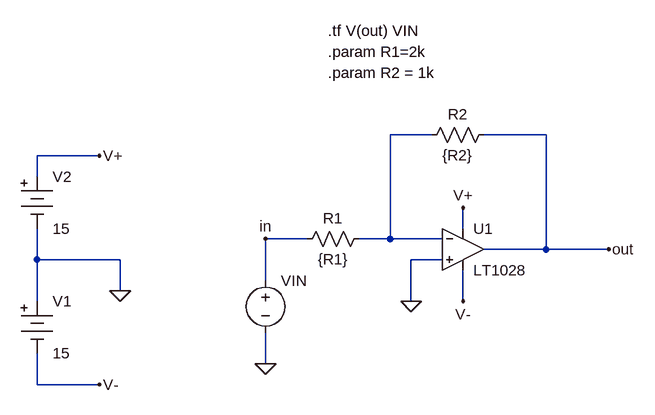
[diagram p0: schematic non_inverting_aop.asc]
non_inverting_aop.asc, the LTspice schematic file:
Version 4.1
SHEET 1 880 680
WIRE 272 0 208 0
WIRE 448 0 352 0
WIRE -240 32 -336 32
WIRE -336 64 -336 32
WIRE 320 144 320 112
WIRE 80 160 16 160
WIRE 208 160 208 0
WIRE 208 160 160 160
WIRE 288 160 208 160
WIRE 448 176 448 0
WIRE 448 176 352 176
WIRE 544 176 448 176
WIRE -336 192 -336 144
WIRE -208 192 -336 192
WIRE 288 192 240 192
WIRE 16 224 16 160
WIRE -208 240 -208 192
WIRE -336 256 -336 192
WIRE 240 256 240 192
WIRE 320 256 320 208
WIRE 16 352 16 304
WIRE -336 384 -336 336
WIRE -240 384 -336 384
FLAG 240 256 0
FLAG -208 240 0
FLAG -240 384 V-
FLAG -240 32 V+
FLAG 320 112 V+
FLAG 320 256 V-
FLAG 16 160 in
FLAG 544 176 out
FLAG 16 352 0
SYMBOL res 176 144 R90
WINDOW 0 0 56 VBottom 2
WINDOW 3 32 56 VTop 2
SYMATTR InstName R1
SYMATTR Value {R1}
SYMBOL res 368 -16 R90
WINDOW 0 0 56 VBottom 2
WINDOW 3 32 56 VTop 2
SYMATTR InstName R2
SYMATTR Value {R2}
SYMBOL OpAmps\\LT1028 320 112 R0
SYMATTR InstName U1
SYMBOL Misc\\battery -336 240 R0
WINDOW 123 0 0 Left 0
WINDOW 39 0 0 Left 0
SYMATTR InstName V1
SYMATTR Value 15
SYMBOL Misc\\battery -336 48 R0
WINDOW 123 0 0 Left 0
WINDOW 39 0 0 Left 0
SYMATTR InstName V2
SYMATTR Value 15
SYMBOL voltage 16 208 R0
WINDOW 123 0 0 Left 0
WINDOW 39 0 0 Left 0
SYMATTR InstName VIN
SYMATTR Value ""
TEXT 112 -128 Left 2 !.param R1=2k
TEXT 112 -160 Left 2 !.tf V(out) VIN
TEXT 112 -96 Left 2 !.param R2 = 1k

The netlist it stands for:
* non_inverting_aop.asc
R1 N001 in {R1}
R2 out N001 {R2}
X§U1 0 N001 V+ V- out LT1028  ; pins In+ In- V+ V- OUT
V1 0 V- 15
V2 V+ 0 15
VIN in 0
.param R1=2k
.tf V(out) VIN
.param R2 = 1k
.lib LTC.lib
.backanno
.end